# Altium schematic sheet 11_BTN_LED_GPIO.SchDoc
size A3
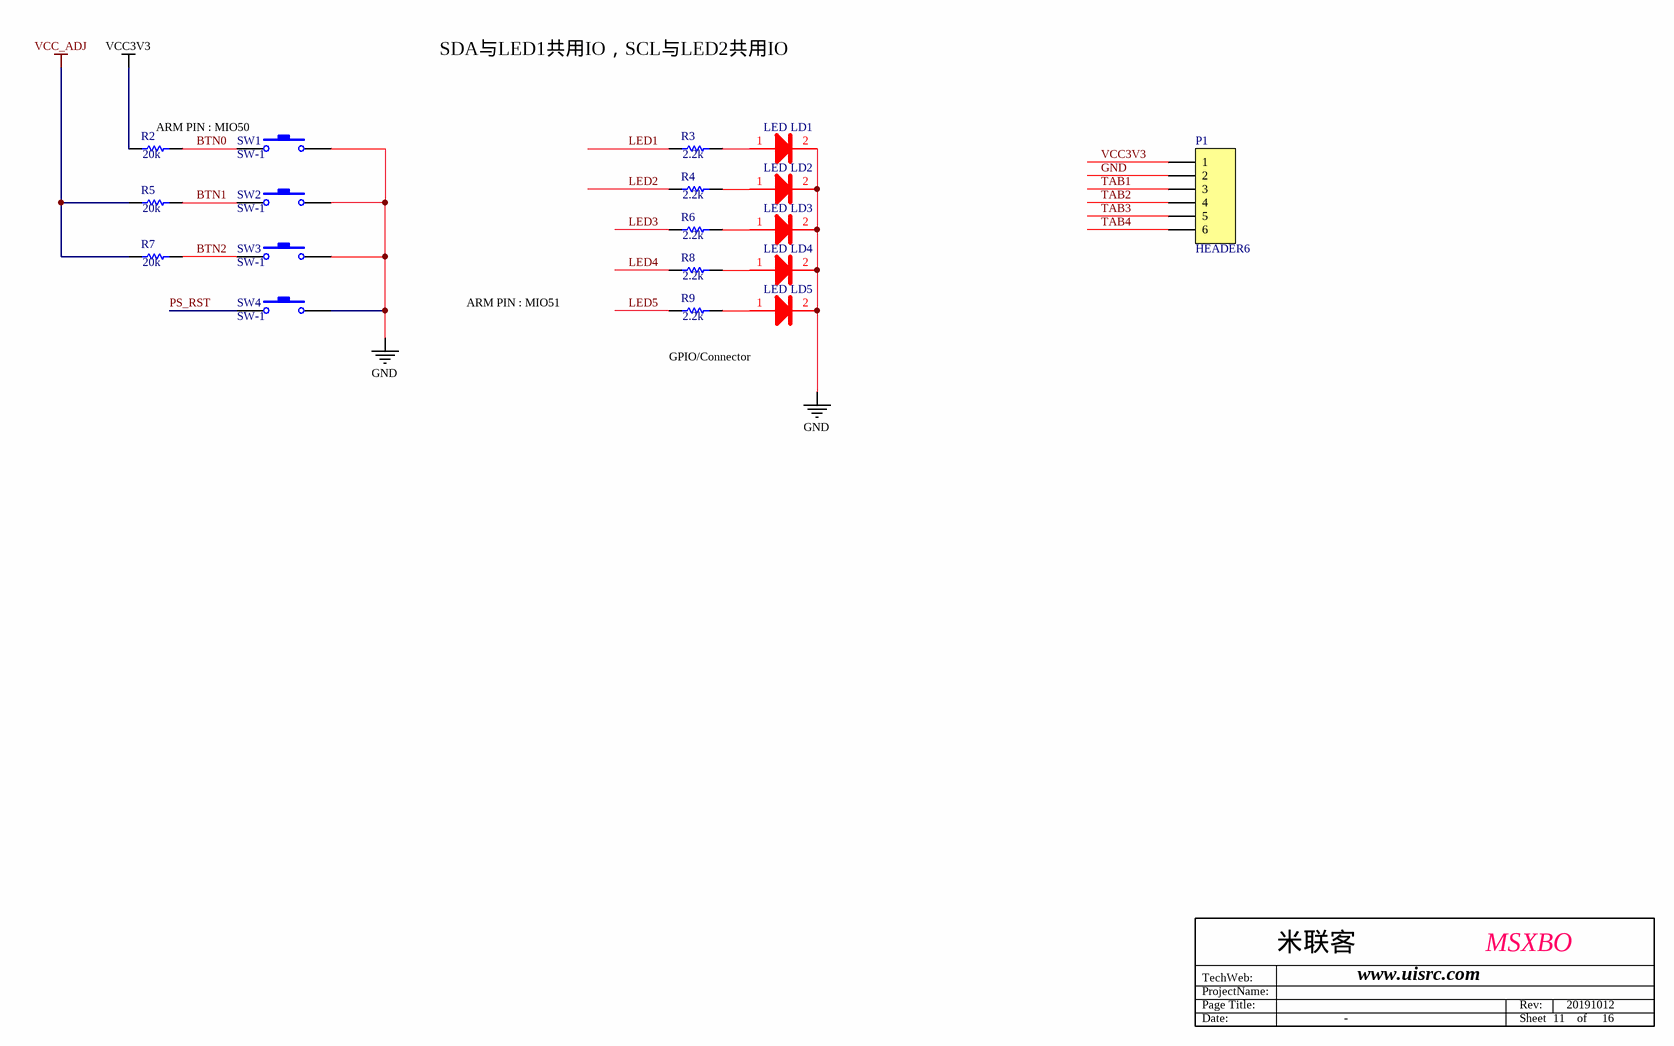
[diagram p0: 11_BTN_LED_GPIO.SchDoc]

## Parts
LD1  LED  [0603D]
LD2  LED  [0603D]
LD3  LED  [0603D]
LD4  LED  [0603D]
LD5  LED  [0603D]
P1  HEADER6  [HEADER1X6]
R2  20k  [R0603]
R3  2.2k  [R0603]
R4  2.2k  [R0603]
R5  20k  [R0603]
R6  2.2k  [R0603]
R7  20k  [R0603]
R8  2.2k  [R0603]
R9  2.2k  [R0603]
SW1  SW-1  [SW-3X9]
SW2  SW-1  [SW-3X9]
SW3  SW-1  [SW-3X9]
SW4  SW-1  [SW-3X9]

## Nets
GND: LD1.2 LD2.2 LD3.2 LD4.2 LD5.2 P1.2 SW1.2 SW2.2 SW3.2 SW4.2
VCC3V3: P1.1 R2.2
VCC_ADJ: R5.2 R7.2
BTN0: R2.1 SW1.1
BTN1: R5.1 SW2.1
BTN2: R7.1 SW3.1
LED1: R3.2
LED2: R4.2
LED3: R6.2
LED4: R8.2
LED5: R9.2
PS_RST: SW4.1
TAB1: P1.3
TAB2: P1.4
TAB3: P1.5
TAB4: P1.6
NetLD1_1: LD1.1 R3.1
NetLD2_1: LD2.1 R4.1
NetLD3_1: LD3.1 R6.1
NetLD4_1: LD4.1 R8.1
NetLD5_1: LD5.1 R9.1

## Notes on the sheet
- SDA与LED1共用IO，SCL与LED2共用IO
- ARM PIN : MIO50
- ARM PIN : MIO51
- GPIO/Connector
- ProjectName:
- TechWeb:
- Page Title:
- 米联客
- www.uisrc.com
- MSXBO
- Rev:
- 20191012
- Date:
- -
- Sheet
- 11    of     16

## Library data of the parts
LD1-LD5 = LEDR
R2-R9 = Res: 1K
SW1-SW4 = SW-1: SW